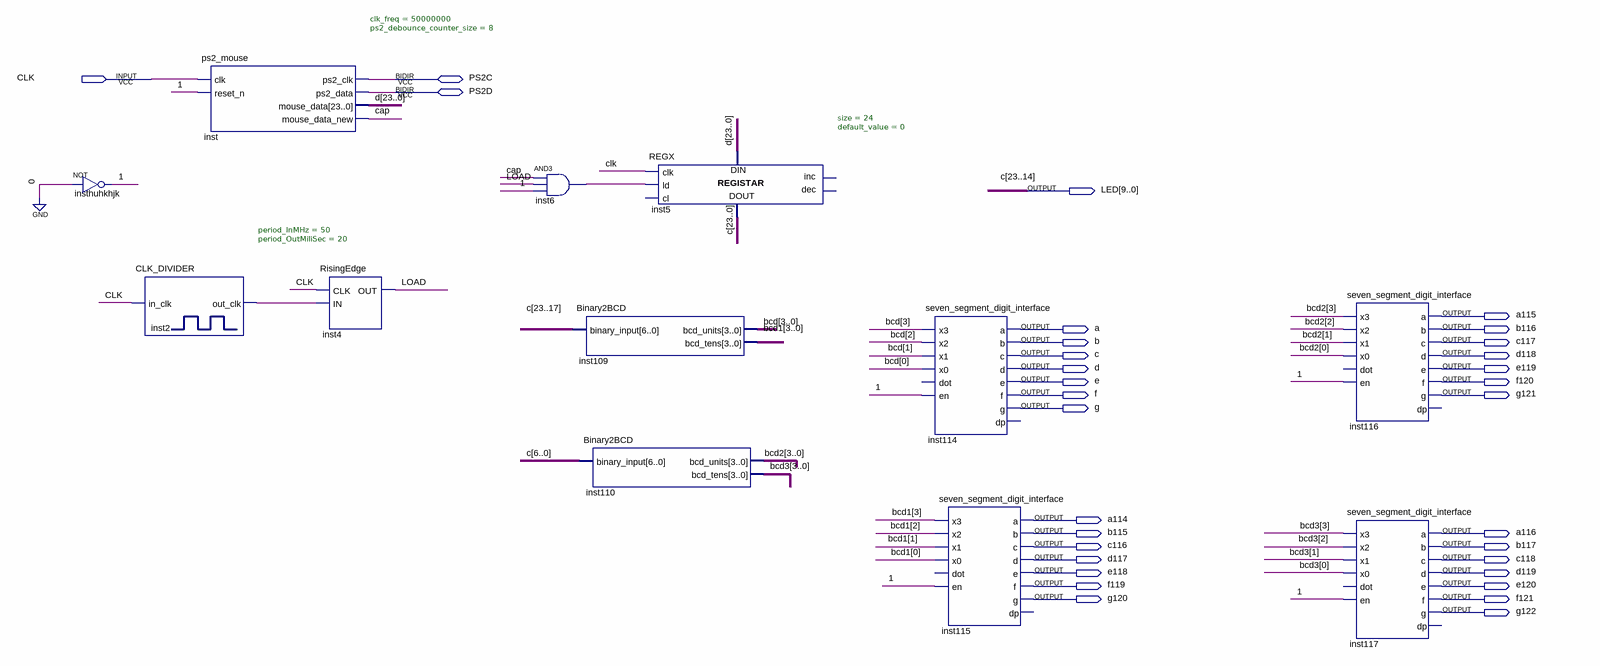
[diagram p0: schematic sheet]
// Quartus schematic test_koda.bdf as structural Verilog: 12 symbols, 32 pins
module test_koda (
  input  CLK,
  inout  PS2C,
  inout  PS2D,
  output [9:0] LED,
  output a115,
  output a,
  output b116,
  output b,
  output c117,
  output c,
  output d118,
  output d,
  output e119,
  output e,
  output f120,
  output f,
  output g121,
  output g,
  output a114,
  output b115,
  output a116,
  output c116,
  output b117,
  output d117,
  output c118,
  output e118,
  output d119,
  output f119,
  output e120,
  output g120,
  output f121,
  output g122
);

  wire \1 , cap, inst2_out_clk, inst6_out, LOAD;
  wire [3:0] bcd, bcd1, bcd2, bcd3;
  wire [13:0] c_bus;
  wire [23:0] d_bus;

  not insthuhkhjk (\1 , 1'b0);
  CLK_DIVIDER #(.period_InMHz(50), .period_OutMiliSec(20)) inst2 (.in_clk(CLK), .out_clk(inst2_out_clk));
  ps2_mouse #(.clk_freq(50000000), .ps2_debounce_counter_size(8)) inst (
    .clk(CLK), .reset_n(\1 ), .mouse_data(d_bus), .mouse_data_new(cap), .ps2_clk(PS2C), .ps2_data(PS2D));
  RisingEdge inst4 (.CLK(CLK), .IN(inst2_out_clk), .OUT(LOAD));
  and inst6 (inst6_out, cap, LOAD, \1 );
  Binary2BCD inst109 (.binary_input(LED[9:3]), .bcd_units(bcd), .bcd_tens(bcd1));
  Binary2BCD inst110 (.binary_input(c_bus[6:0]), .bcd_units(bcd2), .bcd_tens(bcd3));
  REGX #(.size(24), .default_value(0)) inst5 (
    .clk(CLK), .ld(inst6_out), .data_in(d_bus), .data_out({LED, c_bus}));  // open: cl, inc, dec
  seven_segment_digit_interface inst114 (
    .x3(bcd[3]), .x2(bcd[2]), .x1(bcd[1]), .x0(bcd[0]), .en(\1 ), .a(a), .b(b), .c(c), .d(d), .e(e), .f(f),
    .g(g));  // open: dot, dp
  seven_segment_digit_interface inst115 (
    .x3(bcd1[3]), .x2(bcd1[2]), .x1(bcd1[1]), .x0(bcd1[0]), .en(\1 ), .a(a114), .b(b115), .c(c116), .d(d117),
    .e(e118), .f(f119), .g(g120));  // open: dot, dp
  seven_segment_digit_interface inst116 (
    .x3(bcd2[3]), .x2(bcd2[2]), .x1(bcd2[1]), .x0(bcd2[0]), .en(\1 ), .a(a115), .b(b116), .c(c117), .d(d118),
    .e(e119), .f(f120), .g(g121));  // open: dot, dp
  seven_segment_digit_interface inst117 (
    .x3(bcd3[3]), .x2(bcd3[2]), .x1(bcd3[1]), .x0(bcd3[0]), .en(\1 ), .a(a116), .b(b117), .c(c118), .d(d119),
    .e(e120), .f(f121), .g(g122));  // open: dot, dp

  // Other names for the same wires on the sheet: c[23:14] = LED
endmodule
